# EAGLE design mtD-Relay-TBisp2 (EAGLE 7.4.0)
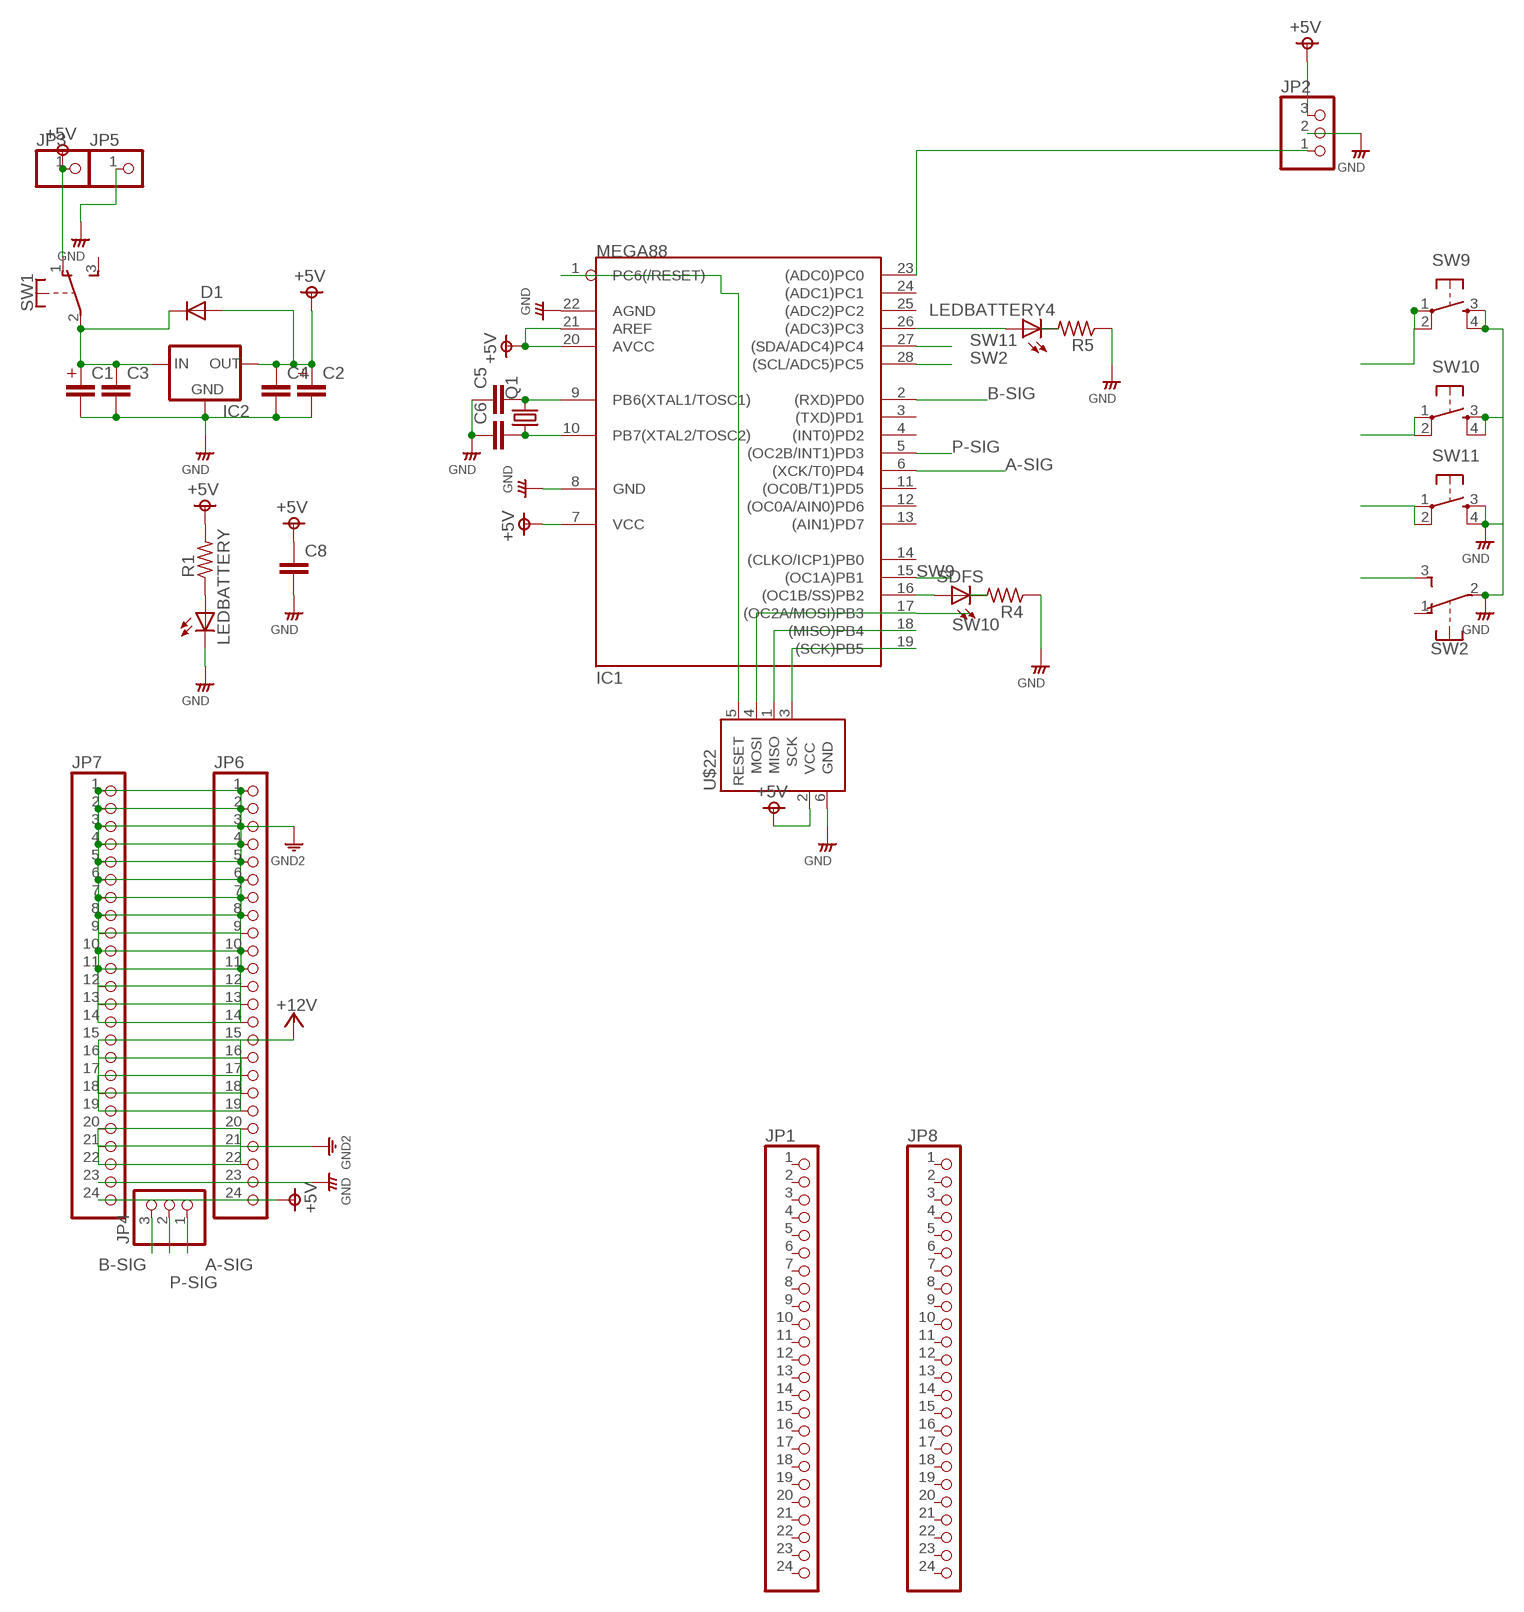
[diagram p0: schematic, sheet 1]

## Parts
C1  CAPACITOR-330U  [C_330U]
C2  CAPACITOR-330U  [C_330U]
C3  MLCC-3  [MLCC_50]
C4  MLCC-3  [MLCC_50]
C5  MLCC-2  [MLCC_25]
C6  MLCC-2  [MLCC_25]
C8  MLCC-3  [MLCC_50]
D1  DIODE_3  [DIODE_3]
IC1  MEGA88  [DIL28-3]
IC2  78  [78XX]
JP1  PINHD-1X24  [1X24]
JP2  PINHD-1X3-1  [1*03]
JP3  PINHD-1X1  [1X01]
JP4  PINHD-1X3-1  [1*03]
JP5  PINHD-1X1  [1X01]
JP6  PINHD-1X24  [1X24]
JP7  PINHD-1X24  [1X24]
JP8  PINHD-1X24  [1X24]
LEDBATTERY  LED5MM  [LED5MM]
LEDBATTERY4  LED3MM  [LED3MM]
Q1  CTYSTALHC49/S  [HC49/S]
R1  RESISTORS-3  [R_0.3]
R4  RESISTORS3216  [3216]
R5  RESISTORS3216  [3216]
SDFS  LED3MM  [LED3MM]
SW1  TOGGLE  [9450-2]
SW2  TOGGLE  [9450-2]
SW9  TACT  [1273]
SW10  TACT  [1273]
SW11  TACT  [1273]
U$22  ISP  [2X03]

## Nets
+5V: C2.P$1 C4.1 C8.1 D1.A IC1.7(VCC) IC1.20(AVCC) IC1.21(AREF) IC2.P$3(OUT) JP2.3 JP3.1 JP6.24 JP7.24 R1.2 SW1.1(O) U$22.2(VCC)
A-SIG: IC1.6((XCK/T0)PD4) JP4.1
B-SIG: IC1.2((RXD)PD0) JP4.3
GND: JP6.23 JP7.23 R4.P$5 R5.P$5 U$22.6(GND)
GND12: JP6.20 JP6.21 JP6.22 JP7.20 JP7.21 JP7.22 ; supply symbol labelled GND2
N$1: C5.2 IC1.9(PB6(XTAL1/TOSC1)) Q1.2
N$2: C6.2 IC1.10(PB7(XTAL2/TOSC2)) Q1.1
N$3: JP6.15 JP6.16 JP6.17 JP6.18 JP6.19 JP7.15 JP7.16 JP7.17 JP7.18 JP7.19 ; supply symbol labelled +12V
N$4: IC1.23((ADC0)PC0) JP2.1
N$5: C1.P$1 C3.1 D1.C IC2.P$1(IN) SW1.2(P)
N$6: IC1.1(PC6(/RESET)) U$22.5(RESET)
N$7: IC1.16((OC1B/SS)PB2) SDFS.A
N$8: R4.P$6 SDFS.K(C)
N$9: IC1.18((MISO)PB4) U$22.1(MISO)
N$10: LEDBATTERY4.K(C) R5.P$6
N$11: C1.P$2 C2.P$2 C3.2 C4.2 C5.1 C6.1 C8.2 IC1.8(GND) IC1.22(AGND) IC2.P$2(GND) JP2.2 JP5.1 LEDBATTERY.K(C) SW2.2(P) SW9.3(S) SW9.4(S1) SW10.3(S) SW10.4(S1) SW11.3(S) SW11.4(S1) ; supply symbol labelled GND
N$13: IC1.19((SCK)PB5) U$22.3(SCK)
N$14: IC1.26((ADC3)PC3) LEDBATTERY4.A
N$40: LEDBATTERY.A R1.1
N$43: JP6.1 JP6.2 JP6.3 JP6.4 JP6.5 JP6.6 JP6.7 JP6.8 JP6.9 JP6.10 JP6.11 JP6.12 JP6.13 JP6.14 JP7.1 JP7.2 JP7.3 JP7.4 JP7.5 JP7.6 JP7.7 JP7.8 JP7.9 JP7.10 JP7.11 JP7.12 JP7.13 JP7.14 ; supply symbol labelled GND2
P-SIG: IC1.5((OC2B/INT1)PD3) JP4.2
SW2: IC1.28((SCL/ADC5)PC5) SW2.3(S)
SW9: IC1.15((OC1A)PB1) SW9.1(P) SW9.2(P1)
SW10: IC1.17((OC2A/MOSI)PB3) SW10.1(P) SW10.2(P1) U$22.4(MOSI)
SW11: IC1.27((SDA/ADC4)PC4) SW11.1(P) SW11.2(P1)
Unconnected: IC1.3((TXD)PD1) IC1.4((INT0)PD2) IC1.11((OC0B/T1)PD5) IC1.12((OC0A/AIN0)PD6) IC1.13((AIN1)PD7) IC1.14((CLKO/ICP1)PB0) IC1.24((ADC1)PC1) IC1.25((ADC2)PC2) JP1.1 JP1.2 JP1.3 JP1.4 JP1.5 JP1.6 JP1.7 JP1.8 JP1.9 JP1.10 JP1.11 JP1.12 JP1.13 JP1.14 JP1.15 JP1.16 JP1.17 JP1.18 JP1.19 JP1.20 JP1.21 JP1.22 JP1.23 JP1.24 JP8.1 JP8.2 JP8.3 JP8.4 JP8.5 JP8.6 JP8.7 JP8.8 JP8.9 JP8.10 JP8.11 JP8.12 JP8.13 JP8.14 JP8.15 JP8.16 JP8.17 JP8.18 JP8.19 JP8.20 JP8.21 JP8.22 JP8.23 JP8.24 SW1.3(S) SW2.1(O)

## Library data of the parts
C1 C2 = rcl__s:CAPACITOR
C3-C6 C8 = rcl__s:MLCC: CAPACITOR, European symbol
D1 = diode_s:DIODE
IC1 = avr_s:MEGA88: MICROCONTROLLER 8 Kbytes FLASH 1 kbytes SRAM 512 bytes EEPROM USART 4-channel 10 bit ADC 2-channel 8 bit ADC Source: avr.lbr
IC2 = regulator_s:78*: VOLTAGE REGULATOR
JP1 JP6-JP8 = pinhead_s:PINHD-1X24: PIN HEADER
JP2 JP4 = pinhead_s:PINHD-1X3: PIN HEADER
JP3 JP5 = pinhead_s:PINHD-1X1: PIN HEADER
LEDBATTERY LEDBATTERY4 SDFS = LED_s:LED: LED OSRAM: - CHIPLED LG R971, LG N971, LY N971, LG Q971, LY Q971, LO R971, LY R971 LH N974, LH R974 LS Q976, LO Q976, LY Q976 LO Q996 - Hyper CHIPLED LW Q18S LB Q993, LB Q99A, LB R99A - SideLED LS A670, LO A670, LY A670, LG A670, LP A670 LB A673, LV A673, LT A673, LW A673 LH A674 LY A675 LS A676, LA A676, LO A676, LY A676, LW A676 LS A679, LY A679, LG A679 - Hyper Micro SIDELED® LS Y876, LA Y876, LO Y876, LY Y876 LT Y87S - SmartLED LW L88C, LW L88S LB L89C, LB L89S, LG L890 LS L89K, LO L89K, LY L89K LS L896, LA L896, LO L896, LY L896 - TOPLED LS T670, LO T670, LY T670, LG T670, LP T670 LSG T670, LSP T670, LSY T670, LOP T670, LYG T670 LG T671, LOG T671, LSG T671 LB T673, LV T673, LT T673, LW T673 LH T674 LS T676, LA T676, LO T676, LY T676, LB T676, LH T676, LSB T676, LW T676 LB T67C, LV T67C, LT T67C, LS T67K, LO T67K, LY T67K, LW E67C LS E67B, LA E67B, LO E67B, LY E67B, LB E67C, LV E67C, LT E67C LW T67C LS T679, LY T679, LG T679 LS T770, LO T770, LY T770, LG T770, LP T770 LB T773, LV T773, LT T773, LW T773 LH T774 LS E675, LA E675, LY E675, LS T675 LS T776, LA T776, LO T776, LY T776, LB T776 LHGB T686 LT T68C, LB T68C - Hyper Mini TOPLED® LB M676 - Mini TOPLED Santana® LG M470 LS M47K, LO M47K, LY M47K Source: http://www.osram.convergy.de - LUMILED® LXK2-PW12-R00, LXK2-PW12-S00, LXK2-PW14-U00, LXK2-PW14-V00 LXK2-PM12-R00, LXK2-PM12-S00, LXK2-PM14-U00 LXK2-PE12-Q00, LXK2-PE12-R00, LXK2-PE12-S00, LXK2-PE14-T00, LXK2-PE14-U00 LXK2-PB12-K00, LXK2-PB12-L00, LXK2-PB12-M00, LXK2-PB14-N00, LXK2-PB14-P00, LXK2-PB14-Q00 LXK2-PR12-L00, LXK2-PR12-M00, LXK2-PR14-Q00, LXK2-PR14-R00 LXK2-PD12-Q00, LXK2-PD12-R00, LXK2-PD12-S00 LXK2-PH12-R00, LXK2-PH12-S00 LXK2-PL12-P00, LXK2-PL12-Q00, LXK2-PL12-R00 Source: www.luxeon.com
Q1 = crystal_s:CTYSTAL: CRYSTAL
R1 R4 R5 = rcl__s:RESISTORS
SW1 SW2 = switch_s:TOGGLE
SW9-SW11 = switch_s:TACT: OMRON SWITCH
U$22 = pinhead_s:ISP

## Board
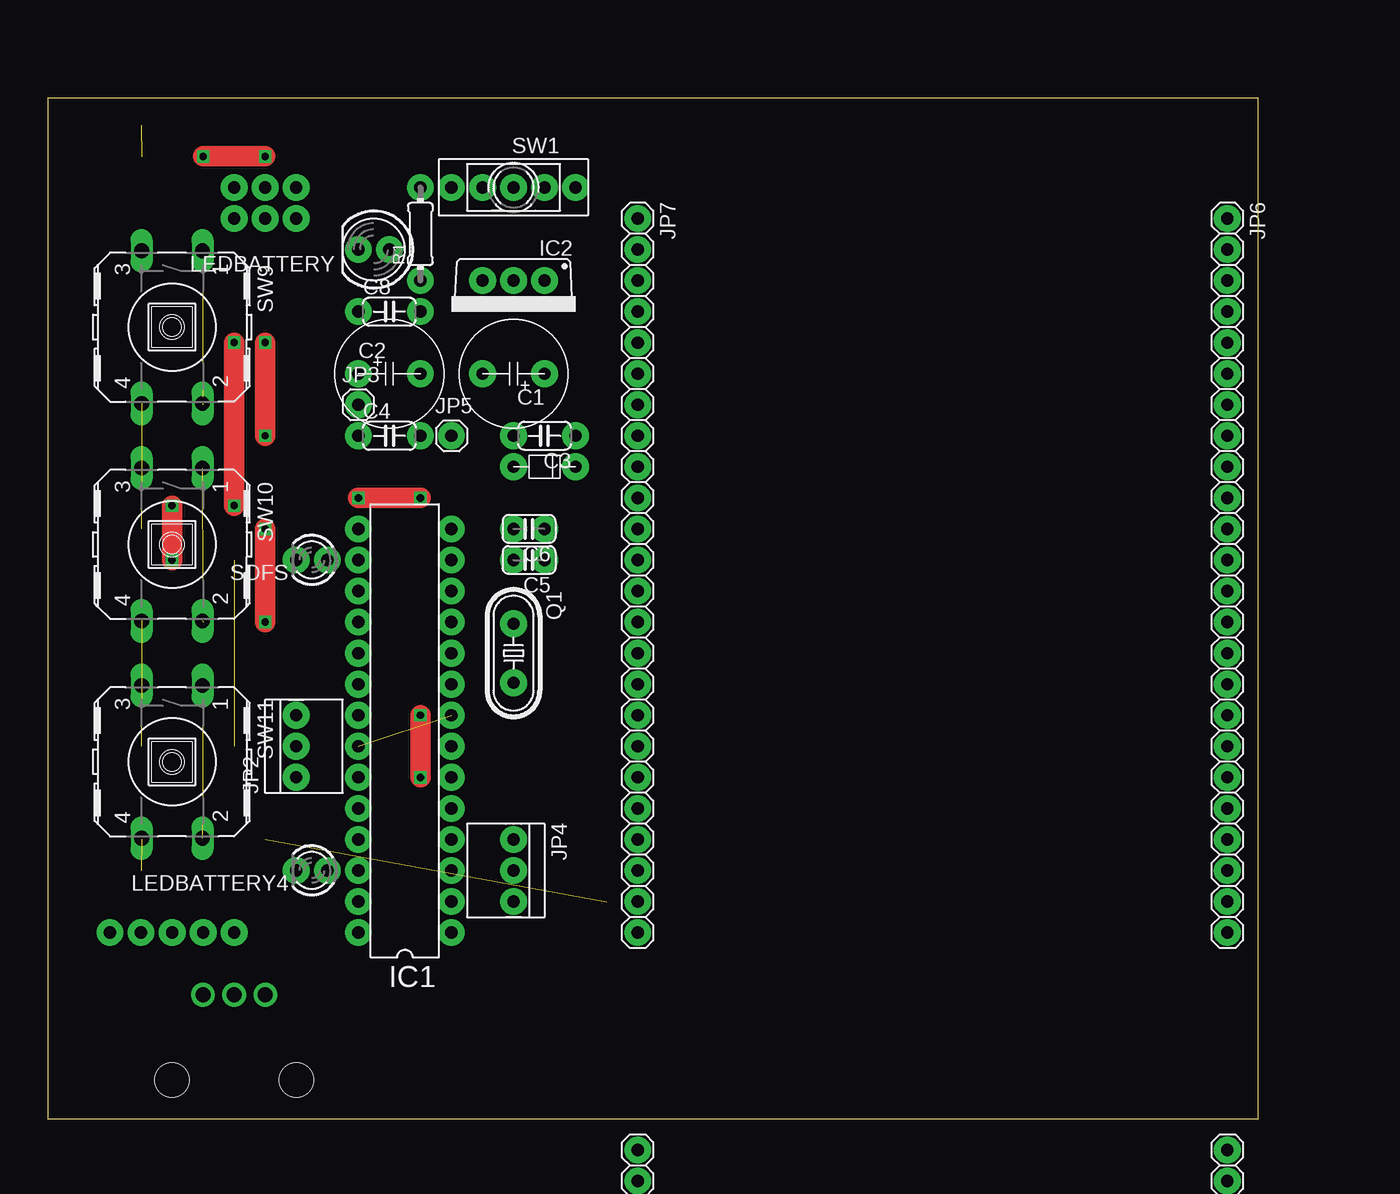
[diagram p1: board, top side]
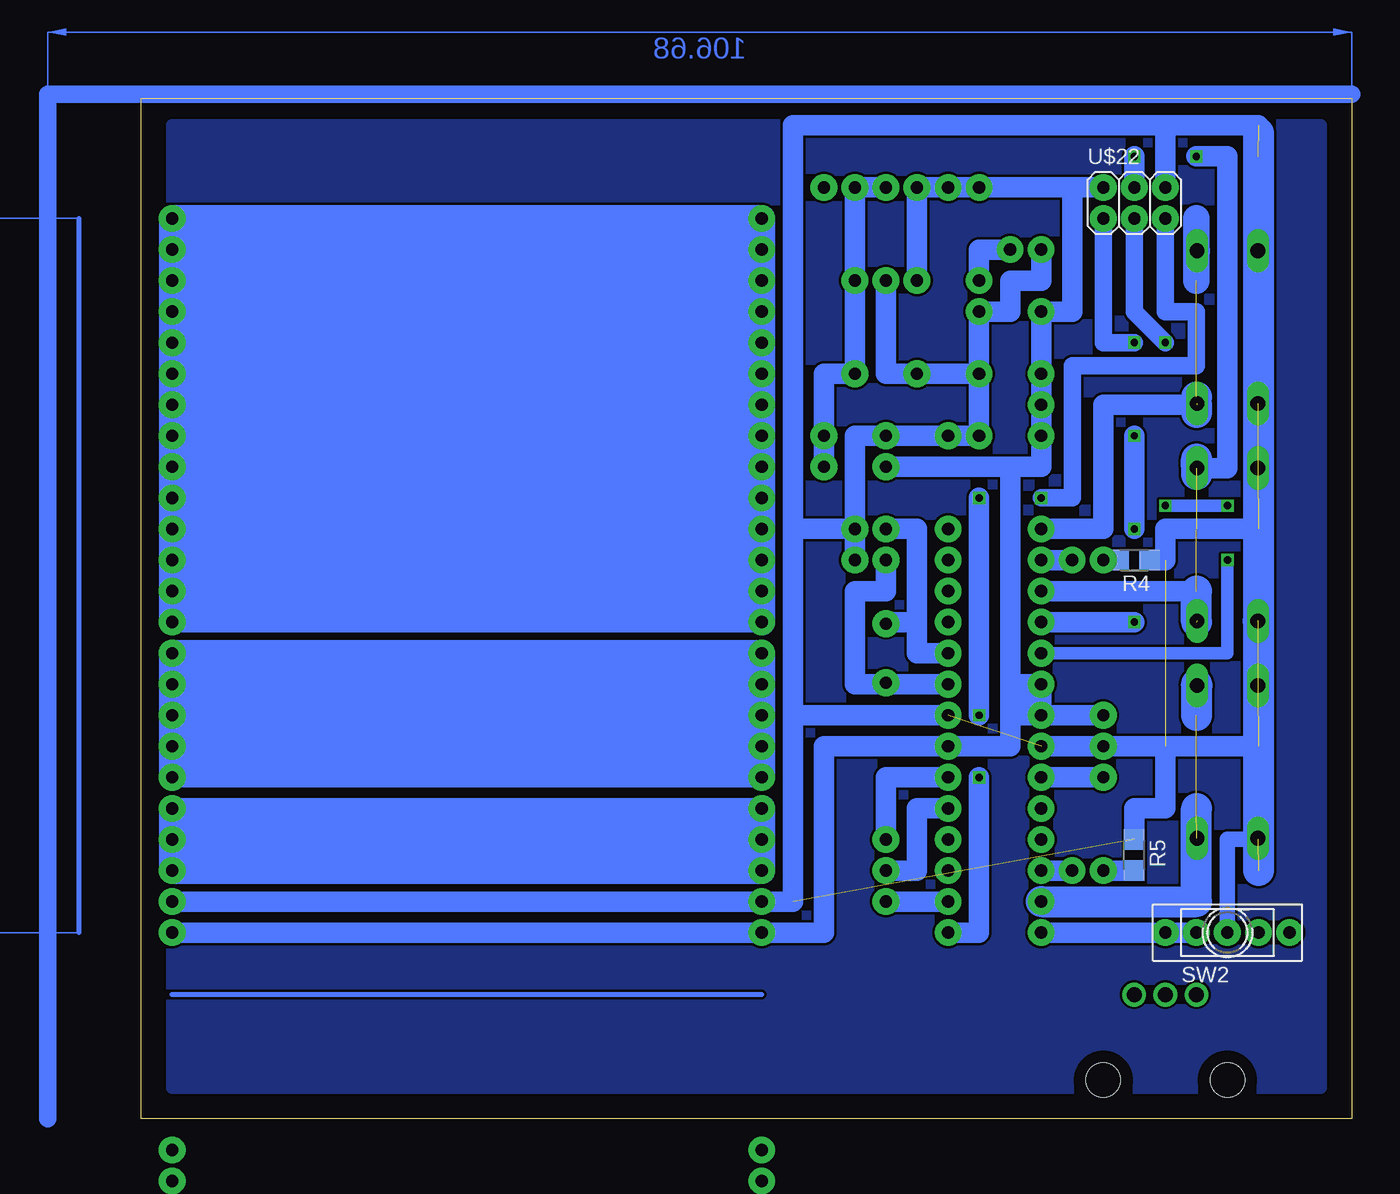
[diagram p2: board, bottom side, seen from below]

Size 99.04 x 83.49 mm. Coordinates in mm from the lower left corner, seen from the top.
Outline: 0,0 99.04,0 99.04,83.49 0,83.49 0,0
Copper layers (1*16): Top 0.035mm / dielectric 1.5mm / Bottom 0.035mm
Design rules "default": minimum track width 10mil, minimum drill 24mil, track to track 8mil, track to pad 8mil, pad to pad 8mil, via to via 8mil, smd to smd 8mil, copper to edge 40mil, drill to drill 8mil, minimum pad ring 10mil, minimum via ring 8mil, stop-mask expansion 4mil, vias tented up to drill 0mil, thermal gap 10mil
Holes 2.8 mm at 20.32,3.17 10.16,3.17

### Footprints (pad centres in the part's own frame; a part is rotated, then mirrored left to right if it is on the bottom)
C_330U = drill 1 pad 2.184: P$1 -2.54,0; P$2 2.54,0
MLCC_50 = drill 1 pad 2.184: 1 -2.54,0; 2 2.54,0
MLCC_25 = drill 1 pad 2.184: 1 -1.27,0; 2 1.27,0
DIODE_3 = drill 1 pad 2.184: A -2.54,0; C 2.54,0
DIL28-3 = drill 1 pad 2.184: 1 -3.81,16.51; 2 -3.81,13.97; 3 -3.81,11.43; 4 -3.81,8.89; 5 -3.81,6.35; 6 -3.81,3.81; 7 -3.81,1.27; 8 -3.81,-1.27; 9 -3.81,-3.81; 10 -3.81,-6.35; 11 -3.81,-8.89; 12 -3.81,-11.43; 13 -3.81,-13.97; 14 -3.81,-16.51; 15 3.81,-16.51; 16 3.81,-13.97; 17 3.81,-11.43; 18 3.81,-8.89; 19 3.81,-6.35; 20 3.81,-3.81; 21 3.81,-1.27; 22 3.81,1.27; 23 3.81,3.81; 24 3.81,6.35; 25 3.81,8.89; 26 3.81,11.43; 27 3.81,13.97; 28 3.81,16.51
78XX = drill 1 pad 2.184: P$1 -2.54,0; P$2 0,0; P$3 2.54,0
1X24 = drill 1 pad 2.184: 1 -29.21,0; 2 -26.67,0; 3 -24.13,0; 4 -21.59,0; 5 -19.05,0; 6 -16.51,0; 7 -13.97,0; 8 -11.43,0; 9 -8.89,0; 10 -6.35,0; 11 -3.81,0; 12 -1.27,0; 13 1.27,0; 14 3.81,0; 15 6.35,0; 16 8.89,0; 17 11.43,0; 18 13.97,0; 19 16.51,0; 20 19.05,0; 21 21.59,0; 22 24.13,0; 23 26.67,0; 24 29.21,0
1*03 = drill 1 pad 2.184: 1 -2.54,0; 2 0,0; 3 2.54,0
1X01 = drill 1 pad 2.184: 1 0,0
LED5MM = drill 1 pad 2.184: A -1.27,0; K 1.27,0
LED3MM = drill 1 pad 2.184: A -1.27,0; K 1.27,0
HC49/S = drill 1 pad 2.184: 1 -2.413,0; 2 2.413,0
R_0.3 = drill 1 pad 2.184: 1 -3.81,0; 2 3.81,0; 3 -3.81,0
3216 = smd 1.676 x 1.676: P$5 0,0; P$6 2.54,0
9450-2 = drill 1 pad 2.184: 1 -2.54,0; 2 0,0; 3 2.54,0; F1 -5.08,0; F2 5.08,0
1273 = drill 1.194 long: 1 -6.248,2.489; 2 6.248,2.489; 3 -6.248,-2.489; 4 6.248,-2.489
2X03 = drill 1 pad 2.184: 1 -2.54,-1.27; 2 -2.54,1.27; 3 0,-1.27; 4 0,1.27; 5 2.54,-1.27; 6 2.54,1.27

### Placement (x,y rotation side)
C1  38.1,60.96 180 top
C2  27.94,60.96 0 top
C3  40.64,55.88 180 top
C4  27.94,55.88 0 top
C5  39.37,45.72 180 top
C6  39.37,48.26 180 top
C8  27.94,66.04 0 top
D1  40.64,53.34 0 top
IC1  29.21,31.75 180 top
IC2  38.1,68.58 180 top
JP1  48.26,-31.75 90 top
JP2  20.32,30.48 90 top
JP3  25.4,58.42 0 top
JP4  38.1,20.32 270 top
JP5  33.02,55.88 0 top
JP6  96.52,44.45 270 top
JP7  48.26,44.45 270 top
JP8  96.52,-31.75 90 top
LEDBATTERY  26.67,71.12 180 top
LEDBATTERY4  21.59,20.32 180 top
Q1  38.1,38.1 270 top
R1  30.48,72.39 90 top
R4  16.51,45.72 180 bottom
R5  17.78,22.86 270 bottom
SDFS  21.59,45.72 180 top
SW1  38.1,76.2 0 top
SW2  10.16,15.24 180 bottom
SW9  10.16,64.77 270 top
SW10  10.16,46.99 270 top
SW11  10.16,29.21 270 top
U$22  17.78,74.93 0 bottom

### Tracks (layer width: path | path; a pad name or v marks a point on that pad's centre or on a via)
+5V
  Bottom 1.676: 27.94,33.02 IC1.21 | IC1.21 JP2.3 | 27.94,33.02 27.94,35.56 | 27.94,35.56 27.94,53.34 | 27.94,53.34 25.4,53.34 C4.1 JP3.1 C2.P$1 C8.1 22.86,66.04 22.86,76.2 | 22.86,76.2 R1.2 SW1.1 IC2.P$3 | 27.94,53.34 D1.A | JP6.24 JP7.24 43.18,15.24 43.18,30.48 IC1.7 27.94,30.48 27.94,33.02 | IC1.21 IC1.20 27.94,35.56 | 27.94,35.56 IC1.21 | U$22.2 22.86,76.2
A-SIG
  Bottom 1.676: JP4.1 38.1,27.94 IC1.6
B-SIG
  Bottom 1.676: IC1.2 JP4.3
GND  (2 unrouted)
  Bottom 1.676: 45.72,17.78 JP7.23 JP6.23 | 7.62,30.48 15.24,30.48 15.24,25.4 17.78,25.4 R5.P$5 | U$22.6 15.24,81.28 7.62,81.28 7.62,80.64 | R4.P$5 15.24,45.72 15.24,48.26
  Bottom 2.54: 7.62,80.64 7.62,30.48
GND12
  Bottom 1.676: JP7.20 JP6.20
  Bottom 2.184: JP6.20 96.52,24.13 | JP6.21 JP6.22 JP7.22 JP7.21 | JP7.21 JP7.20 | JP7.21 JP6.21 | JP6.21 96.52,24.13 | 96.52,24.13 49.53,24.13 49.53,21.59 95.88,21.59
N$1
  Bottom 0.406: Q1.2 40.51,35.69 40.64,35.56
  Bottom 1.676: IC1.9 37.97,35.56 Q1.2 | 38.1,35.56 40.64,35.56 40.64,43.18 38.1,43.18 C5.2
N$2
  Bottom 0.406: Q1.1 35.69,40.51 35.56,40.64
  Bottom 1.676: 38.1,40.64 35.56,40.64 | 35.56,40.64 35.56,48.26 C6.2 | IC1.10 35.56,38.1 35.56,40.64
N$3
  Bottom 1.676: JP6.15 JP7.15 | JP6.19 JP7.19
  Bottom 2.184: JP7.19 JP7.18 | JP7.18 JP7.17 | JP7.17 JP7.16 | JP7.16 JP7.15 | 96.52,36.83 JP6.16 | JP6.17 JP6.18 | JP6.18 96.52,29.84 | JP7.17 JP6.17 | JP6.17 JP6.16 | JP6.16 JP7.16 | JP7.16 JP7.18 | JP7.18 JP6.18 | JP6.19 96.52,29.84 | 96.52,29.84 48.9,29.84 | 48.9,29.84 48.9,29.21 | 48.9,29.84 48.9,32.39 95.25,32.39 95.25,34.29 48.9,34.29 48.9,36.83 96.52,36.83 | 96.52,36.83 JP6.15
N$4
  Bottom 1.676: IC1.23 JP2.1
N$5
  Bottom 1.676: D1.C C3.1 43.18,60.96 C1.P$1 IC2.P$1 40.64,76.2 SW1.2
N$6  (via drill 0.6)
  Top 1.676: v30.48,27.94 v30.48,33.02 | v30.48,50.8 v25.4,50.8
  Bottom 1.422: U$22.5 15.24,66.04 12.7,66.04 12.7,61.59 22.86,61.59 22.86,50.8 v25.4,50.8
  Bottom 1.676: IC1.1 30.48,15.24 v30.48,27.94 | v30.48,33.02 v30.48,50.8
N$7
  Bottom 1.676: IC1.16 SDFS.A
N$8
  Bottom 1.676: SDFS.K R4.P$6
N$9  (via drill 0.6)
  Top 1.676: v17.78,40.64 v17.78,48.26 | v17.78,55.88 v17.78,63.5
  Bottom 1.422: v17.78,63.5 20.32,63.5 U$22.1
  Bottom 1.676: IC1.18 v17.78,40.64 | v17.78,48.26 v17.78,55.88
N$10
  Bottom 1.676: LEDBATTERY4.K R5.P$6
N$11  (7 unrouted)
  Bottom 1.016: SW9.3 7.67,78.69
  Bottom 1.27: 7.67,22.86 10.16,22.86 SW2.2
  Bottom 1.676: C6.1 45.72,48.26 | 45.72,48.26 45.72,33.02 | 45.72,33.02 45.72,17.78 | IC1.8 45.72,33.02 | IC1.22 JP2.2 7.62,30.48 7.62,48.26 15.24,48.26 | LEDBATTERY.K 25.4,68.58 27.94,68.58 27.94,66.04 C8.2 C2.P$2 | C2.P$2 C4.2 JP5.1 C3.2 40.64,55.88 C6.1 | IC2.P$2 38.1,60.96 C1.P$2 C2.P$2 | 45.72,48.26 45.72,81.28 7.62,81.28 | C6.1 C5.1
  Bottom 2.184: 7.67,22.86 SW11.4 7.62,22.96
  Bottom 2.54: SW10.4 7.62,40.74 7.62,20.32
N$12
  pour Bottom: 2.54,81.28 96.52,81.28 96.52,2.54 2.54,2.54
N$13  (via drill 0.6)
  Top 1.676: v10.16,50.17 v10.16,45.72 | v15.24,50.17 v15.24,63.5
  Bottom 1.016: v10.16,45.72 10.16,38.1 IC1.19 | v10.16,50.17 v15.24,50.17
  Bottom 1.422: v15.24,63.5 17.78,66.04 U$22.3
N$14
  Bottom 1.676: IC1.26 LEDBATTERY4.A
N$16  (via drill 1.2 pad 1.93)
  other vias: 12.7,10.16
N$18
  Bottom 2.54: 12.7,53.98 12.7,53.34 12.7,52.7
N$19  (via drill 1.2 pad 1.93)
  other vias: 15.24,10.16
N$20  (via drill 1.2 pad 1.93)
  other vias: 17.78,10.16
N$21
  Bottom 1.422: 106.68,0 106.68,83.82 0,83.82
N$22
  Bottom 0.406: 48.26,10.16 96.52,10.16
N$23
  Bottom 0.406: 104.14,73.66 104.14,15.24
N$40
  Bottom 1.676: LEDBATTERY.A 30.48,71.12 R1.1
N$43
  Bottom 1.676: JP7.14 JP6.14
  Bottom 2.184: 96.52,71.75 JP6.2 | JP6.3 JP6.4 | JP6.5 JP6.6 | JP6.7 JP6.8 | JP6.9 JP6.10 | JP6.11 JP6.12 | JP6.13 JP6.14 | JP7.14 JP7.13 | JP7.13 JP7.12 | JP7.11 JP7.10 | JP7.9 JP7.8 | JP7.7 JP7.6 | JP7.5 JP7.4 | JP7.3 JP7.2 | JP7.2 JP7.1 JP6.1 96.52,71.75 | JP7.13 JP6.13 | JP6.13 JP6.12 | JP6.12 JP7.12 | JP7.12 JP7.11 | JP7.11 JP6.11 | JP6.11 JP6.10 | JP6.10 JP7.10 | JP7.10 JP7.9 | JP7.9 JP6.9 | JP6.9 JP6.8 | JP6.8 JP7.8 | JP7.8 JP7.7 | JP7.7 JP6.7 | JP6.7 JP6.6 | JP6.6 95.88,60.96 | 95.88,60.96 49.53,60.96 | 49.53,60.96 JP7.6 | JP7.6 JP7.5 | JP7.5 JP6.5 | JP6.5 JP6.4 | JP6.4 48.9,66.04 | 48.9,66.04 JP7.4 | JP7.4 JP7.3 | JP7.3 48.9,68.58 | 48.9,68.58 JP6.3 | JP6.3 JP6.2 | JP6.2 JP7.2 | 96.52,71.75 48.9,71.75 48.9,69.85 | 48.9,68.58 48.9,69.85 | 48.9,69.85 95.25,69.85 95.25,66.67 48.9,66.67 48.9,66.04 | 48.9,66.04 48.9,64.77 | 48.9,64.77 95.25,64.77 95.25,62.23 49.53,62.23 49.53,60.96 | 49.53,60.96 49.53,59.69 95.88,59.69 | 95.88,59.69 95.88,60.96 | 95.88,59.69 95.88,57.15 48.9,57.15 48.9,54.61 95.88,54.61 | 95.88,54.61 95.88,55.25 | 95.88,54.61 95.88,52.07 49.53,52.07 49.53,49.53 95.88,49.53 95.88,46.99 49.53,46.99 49.53,44.45 95.88,44.45 95.88,42.55 48.9,42.55 | JP7.11 JP7.10 | 48.26,38.1 96.52,38.1 | JP7.13 JP7.12 | 48.9,64.77 95.88,64.77
P-SIG
  Bottom 1.676: JP4.2 35.56,20.32 35.56,25.4 IC1.5
SW2
  Bottom 1.676: SW2.3 IC1.28
SW9  (2 unrouted)
  Bottom 1.676: IC1.15 20.32,48.26 20.32,58.42 12.7,58.42 12.65,58.42
  Bottom 2.184: SW9.1 12.7,71.02 | 12.7,71.02 12.7,73.66 | 12.7,71.02 12.7,68.58
  Bottom 2.54: 12.7,59.06 12.7,58.42 12.7,57.78
SW10  (via drill 0.6)  (2 unrouted)
  Top 1.676: v12.7,78.74 v17.78,78.74
  Bottom 1.676: IC1.17 12.7,43.18 | SW10.1 10.16,53.24 10.16,78.74 v12.7,78.74 | v17.78,78.74 U$22.4
  Bottom 2.54: 12.7,40.64 12.7,43.18
SW11  (2 unrouted)
  Bottom 2.54: IC1.27 12.7,17.78 12.7,25.4 | SW11.1 12.7,35.46 | 12.7,35.46 12.7,35.56 | 12.7,35.46 12.7,33.02
(copper drawn outside any net)
  shapes: Bottom area x3